# Altium project Battman.PrjPcb
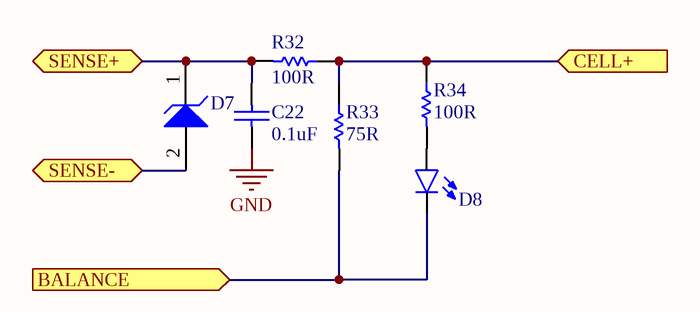
[diagram p0: Cell.SchDoc]
5 sheets, 37 parts. Net scope: hierarchical (ports join the sheet entries above them; power ports are global).
Board file: BMS.PcbDoc
Sheets:
  Cell.SchDoc
  BMS.SchDoc
    U_Switches = Switches.SchDoc
    U_Connectors = Connectors.SchDoc
    U_CurrentSense = CurrentSense.SchDoc

## Sheet Cell.SchDoc
size A; SheetNumber: 5

### Parts
C22  value 0.1uF  [C0402[1005X55]]  (hidden comment: 0.1uF 6.3V 0402)
D7  MM3Z12VT1G  [ONSC-SOD-323-2-477-02_V]  (value not drawn)
D8  LED_0603  [LED0603]  (value not drawn)
R32  value 100R  [R0402[1005]]  (hidden comment: 100R 1% 0402)
R33  value 75R  [R0603[1608]]  (hidden comment: 75R 1% 0603)
R34  value 100R  [R0402[1005]]  (hidden comment: 100R 1% 0402)

### Ports
BALANCE (in), CELL+ (in), SENSE+, SENSE- (bidir)

### Nets
GND: C22.1
NetC22_2: C22.2 D7.1(K) R32.1 ; port SENSE+
NetD7_2: D7.2(A) ; port SENSE-
NetD8_A: D8.A R34.1
NetD8_C: D8.C R33.1 ; port BALANCE
NetR32_2: R32.2 R33.2 R34.2 ; port CELL+

### Library data of the parts
C22 = CAP_0.1uF_6.3V_0402_10%: 0.1uF 6.3V 10% 0402 (1005 Metric); PartNumber: GRM155R70J104KA01D; Manufacturer: Murata; Tolerance: 10%; Mounting Technology: Surface Mount; PackageReference: 0402; PackageDescription: 0402 (1005 Metric); Voltage: 6.3V
D7 = CMP-1060-00726-1: Zener Voltage Regulator, 300 mW, 2-Pin SOD-323, Tape and Reel; Manufacturer: On Semiconductor; VZ Typ (V): 12; P Max (W): 0.3; Packing: Tape and Reel; ComponentLink3URL: http://www.onsemi.com/pub_link/Collateral/477-02.PDF.1; ComponentLink2Description: Datasheet; Mounting Technology: Surface Mount; PackageVersion: Rev. H, 03/2007; PackageDescription: 2-Pin SOD, Body 1.7 x 1.25 mm; ComponentLink1URL: http://www.onsemi.com/; ComponentLink1Description: Manufacturer URL; PartNumber: MM3Z12VT1G; ComponentLink3Description: Package Specification; ComponentLink2URL: http://www.onsemi.cn/pub_link/Collateral/MM3Z2V4T1-D.PDF; DatasheetVersion: Rev. 9; PackageReference: SOD-323-2-477-02
D8 = LED_0603: PartNumber: LTST-C193TBKT-5A; Manufacturer: Lite-On Inc.; PackageReference: 0603; PackageDescription: 0603 (1608 Metric); Mounting Technology: Surface Mount
R32 R34 = RES_100R_0402_1%: 100R 0.063W 1% 0402 (1005 Metric); Manufacturer: KOA Speer; PartNumber: RK73H1ETTP1000F; Power: 0.063W; Tolerance: 1%; Mounting Technology: Surface Mount; PackageReference: 0402; PackageDescription: 0402 (1005 Metric); ComponentLink1Description: Datasheet; ComponentLink1URL: http://www.koaspeer.com/catimages/Products/RK73H/RK73H.pdf
R33 = RES_75R_0603_1%: 75R 0.25W 1% 0603 (1005 Metric); Manufacturer: Vishay / Dale; PartNumber: CRCW060375R0FKEAHP; Tolerance: 1%; Power: 0.25W; Mounting Technology: Surface Mount; PackageReference: 0603; PackageDescription: 0603 (1608 Metric); ComponentLink1Description: Datasheet; ComponentLink1URL: http://www.vishay.com/docs/20043/crcwhpe3.pdf

## Sheet BMS.SchDoc
size A; SheetNumber: 1
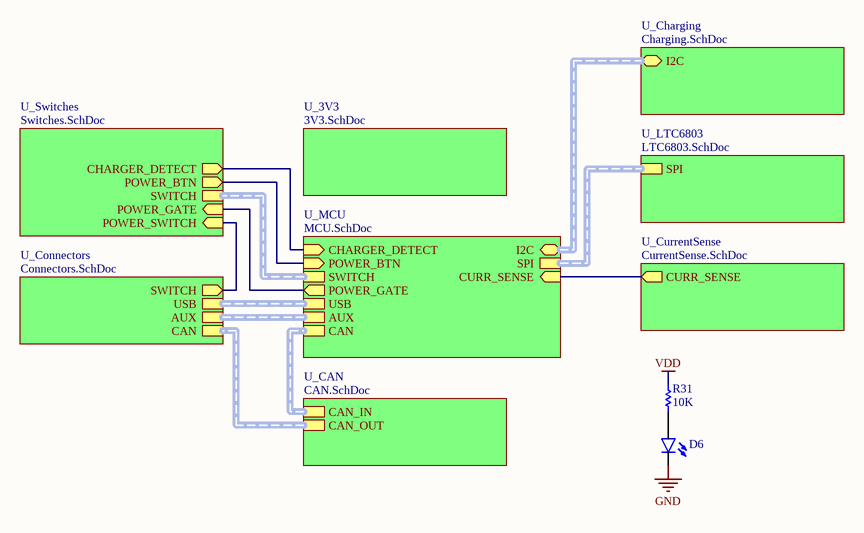
[diagram p1: BMS.SchDoc]

### Parts
D6  LED-BLUE  [LED0603]  (value not drawn)
R31  value 10K  [R0603[1608]]  (hidden comment: 10K 5% 0603)

### Sub-sheets
U_3V3 = 3V3.SchDoc (file not in this document): no entries
U_CAN = CAN.SchDoc (file not in this document): CAN_IN (harness CAN Input), CAN_OUT (harness CAN Output)
U_Charging = Charging.SchDoc (file not in this document): I2C (harness I2C)
U_Connectors = Connectors.SchDoc: USB (harness USB), AUX (harness Auxiliary Outputs), SWITCH (out), CAN (harness CAN Output)
U_CurrentSense = CurrentSense.SchDoc: CURR_SENSE (out)
U_LTC6803 = LTC6803.SchDoc (file not in this document): SPI (harness SPI)
U_MCU = MCU.SchDoc (file not in this document): CHARGER_DETECT (in), POWER_BTN (in), POWER_GATE (out), SPI (harness SPI), USB (harness USB), CAN (harness CAN Input), AUX (harness Auxiliary Outputs), SWITCH (harness Switches), CURR_SENSE (in), I2C (harness I2C)
U_Switches = Switches.SchDoc: POWER_GATE (in), POWER_BTN (out), CHARGER_DETECT (out), SWITCH (harness Switches), POWER_SWITCH (in)

### Nets
GND: D6.C
VDD: R31.2
NetD6_A: D6.A R31.1
NetJP4_1: sheet U_Switches/POWER_SWITCH, sheet U_Connectors/SWITCH
NetQ4_1: sheet U_MCU/CHARGER_DETECT, sheet U_Switches/CHARGER_DETECT
NetQ7_1: sheet U_MCU/POWER_GATE, sheet U_Switches/POWER_GATE
NetQ8_1: sheet U_MCU/POWER_BTN, sheet U_Switches/POWER_BTN
NetU9_5: sheet U_MCU/CURR_SENSE, sheet U_CurrentSense/CURR_SENSE

### Buses and harness runs
harness sheet U_CAN/CAN_IN = sheet U_MCU/CAN
harness sheet U_CAN/CAN_OUT = sheet U_Connectors/CAN
harness sheet U_Charging/I2C = sheet U_MCU/I2C
harness sheet U_Connectors/AUX = sheet U_MCU/AUX
harness sheet U_Connectors/USB = sheet U_MCU/USB
harness sheet U_LTC6803/SPI = sheet U_MCU/SPI
harness sheet U_MCU/SWITCH = sheet U_Switches/SWITCH

### Library data of the parts
D6 = LED_0603: as D8 on sheet Cell; PackageReference: 0603; PackageDescription: 0603 (1608 Metric); Mounting Technology: Surface Mount
R31 = RES_10K_0603_5%: 10K 0.25W 5% 0603 (1005 Metric); Manufacturer: Vishay; PartNumber: RCS060310K0JNEA; Tolerance: 5%; Power: 0.25W; Mounting Technology: Surface Mount; PackageReference: 0603; PackageDescription: 0603 (1608 Metric); ComponentLink1Description: Datasheet; ComponentLink1URL: http://www.vishay.com/docs/20065/rcse3.pdf

## Sheet Switches.SchDoc
size A; SheetNumber: 7
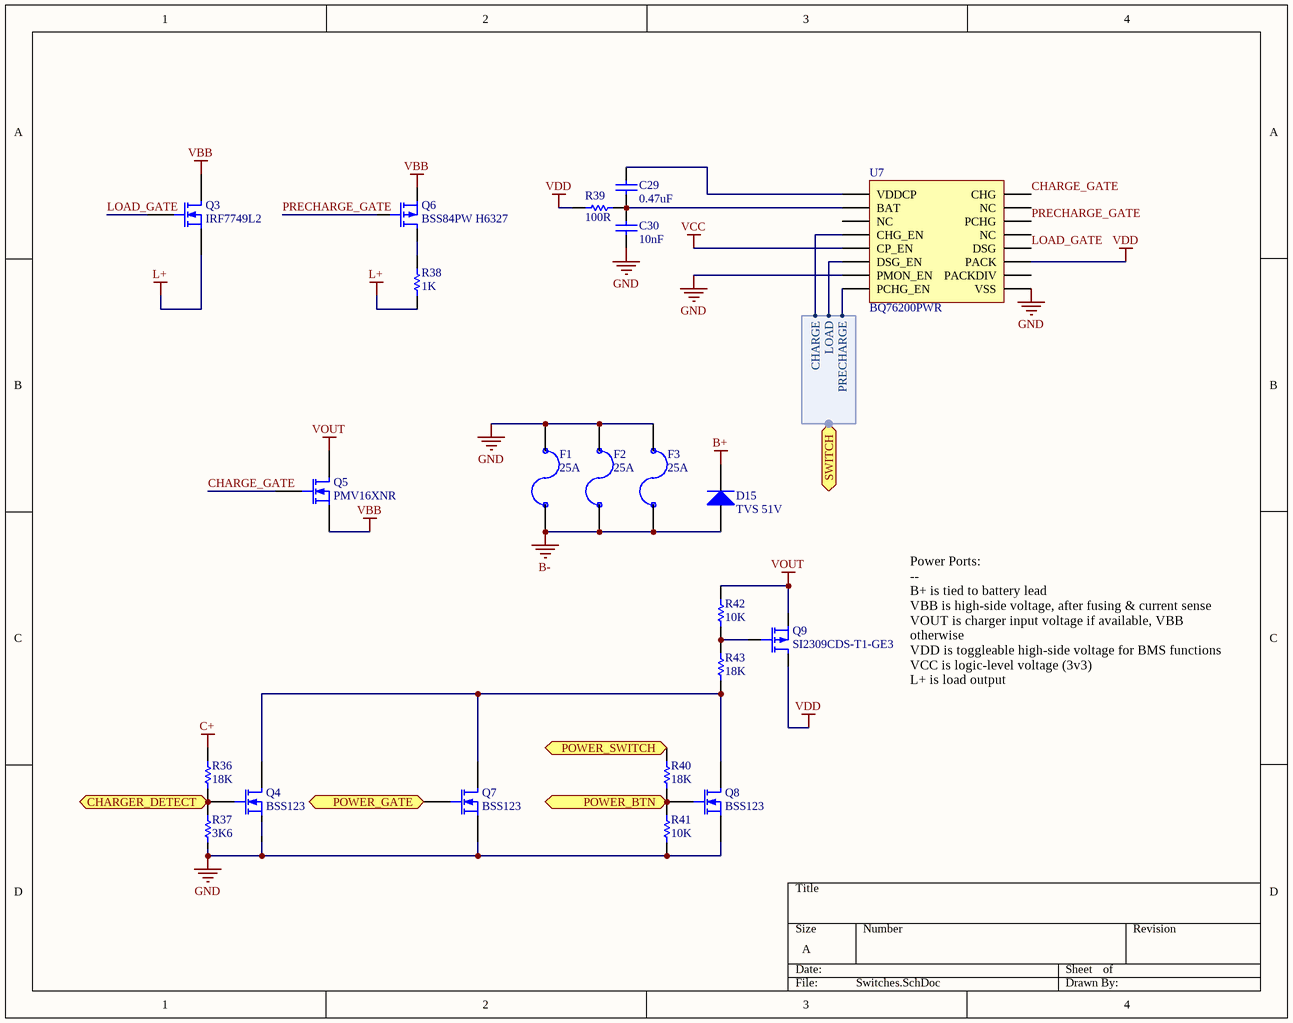
[diagram p2: Switches.SchDoc]

### Parts
C29  value 0.47uF  [C0603[1608X92]]  (hidden comment: 0.47uF 50V 0603)
C30  value 10nF  [C0402[1005X55]]  (hidden comment: 10nF 50V 0402)
D15  TVS 51V  [VISH-DO-214AC-2_N]
F1  Current: 25A  [1206_FUSE]  (hidden comment: FUSE 1206)
F2  Current: 25A  [1206_FUSE]  (hidden comment: FUSE 1206)
F3  Current: 25A  [1206_FUSE]  (hidden comment: FUSE 1206)
Q3  IRF7749L2  [DIRECTFET-9]
Q4  BSS123  [SOT323-3]
Q5  PMV16XNR  [SOT23-3]
Q6  BSS84PW H6327  [SOT323-3]
Q7  BSS123  [SOT323-3]
Q8  BSS123  [SOT323-3]
Q9  SI2309CDS-T1-GE3  [SOT23-3]
R36  value 18K  [R0402[1005]]  (hidden comment: 18K 1% 0402)
R37  value 3K6  [R0402[1005]]  (hidden comment: 3K6 1% 0402)
R38  value 1K  [R0805[2012]]  (hidden comment: 1K 1% 0805)
R39  value 100R  [R0402[1005]]  (hidden comment: 100R 1% 0402)
R40  value 18K  [R0402[1005]]  (hidden comment: 18K 1% 0402)
R41  value 10K  [R0402[1005]]  (hidden comment: 10K 1% 0402)
R42  value 10K  [R0402[1005]]  (hidden comment: 10K 1% 0402)
R43  value 18K  [R0402[1005]]  (hidden comment: 18K 1% 0402)
U7  BQ76200PWR  [TSSOP-16]

### Ports
CHARGER_DETECT (out), POWER_BTN (out), POWER_GATE (in), POWER_SWITCH (in), SWITCH (harness Switches)

### Harnesses
Switches: CHARGE, LOAD, PRECHARGE

### Nets
B+: D15.1(K)
B-: D15.2(A) F1.2 F2.2 F3.2
C+: R36.2
GND: C30.1 F1.1 F2.1 F3.1 Q4.2(S) Q7.2(S) Q8.2(S) R37.1 R41.1 U7.7(PMON_EN) U7.9(VSS)
L+: Q3.2(S) R38.1
VBB: Q3.3(D) Q5.2(S) Q6.2(S)
VCC: U7.5(CP_EN)
VDD: Q9.2(D) R39.1 U7.11(PACK)
VOUT: Q5.3(D) Q9.3(S) R42.2
CHARGE_GATE: Q5.1(G) U7.16(CHG)
LOAD_GATE: Q3.1(G) U7.12(DSG)
PRECHARGE_GATE: Q6.1(G) U7.14(PCHG)
NetC29_1: C29.1 C30.2 R39.2 U7.2(BAT)
NetC29_2: C29.2 U7.1(VDDCP)
NetJP4_1: R40.2 ; port POWER_SWITCH
NetQ4_1: Q4.1(G) R36.1 R37.2 ; port CHARGER_DETECT
NetQ4_3: Q4.3(D) Q7.3(D) Q8.3(D) R43.1
NetQ6_3: Q6.3(D) R38.2
NetQ7_1: Q7.1(G) ; port POWER_GATE
NetQ8_1: Q8.1(G) R40.1 R41.2 ; port POWER_BTN
NetQ9_1: Q9.1(G) R42.1 R43.2
NetU7_4: U7.4(CHG_EN) ; port SWITCH.CHARGE
NetU7_6: U7.6(DSG_EN) ; port SWITCH.LOAD
NetU7_8: U7.8(PCHG_EN) ; port SWITCH.PRECHARGE

Not connected (* = marked no-connect by the designer): U7 3(NC) 10(PACKDIV) 13(NC) 15(NC)

### Notes on the sheet
- Power Ports:
  --
  B+ is tied to battery lead
  VBB is high-side voltage, after fusing & current sense
  VOUT is charger input voltage if available, VBB otherwise
  VDD is toggleable high-side voltage for BMS functions
  VCC is logic-level voltage (3v3)
  L+ is load output

### Library data of the parts
C29 = CAP_0.47uF_50V_0603_10%: 0.47uF 50V 10% 0603 (1608 Metric); PartNumber: GRM188R61H474KA12D; Manufacturer: Murata; Tolerance: 10%; Mounting Technology: Surface Mount; PackageReference: 0603; PackageDescription: 0603 (1608 Metric); Voltage: 50V
C30 = CAP_10nF_50V_0402_10%: 10nF 50V 10% 0402 (1005 Metric); PartNumber: GCM155R71H103KA55D; Manufacturer: Murata; Tolerance: 10%; Mounting Technology: Surface Mount; PackageReference: 0402; PackageDescription: 0402 (1005 Metric); Voltage: 50V
D15 = CMP-0548-00253-1: Transient Voltage Suppressor, 6.40 to 231 V, 45 V Stand-off Voltage, Uni-Directional, -55 to 155 degC, 2-pin DO-214AC, Pb-Free, Tape and Reel; PartNumber: SMAJ51A-E3/61; Manufacturer: Vishay Semiconductor; IFSM: 40 A; VWM (V): 51; VBR Uni-Directional (V): 6.4 to 231; ID (uA): 1; PPPM (W): 400, 300; ComponentLink2Description: Datasheet; PackageReference: DO-214AC-2; ComponentLink3URL: http://www.vishay.com/docs/88390/smaj50a.pdf; DatasheetVersion: 12/8/2013; RoHS: TRUE; ComponentLink2URL: http://www.vishay.com/docs/88390/smaj50a.pdf; ComponentLink1Description: Manufacturer URL; PackageDescription: 2-Pin DO-214AC (SMA), Body 4.245 x 2.665 mm; Mounting Technology: Surface Mount; Packing: Tape and Reel; ComponentLink3Description: Package Specification; ComponentLink1URL: http://www.vishay.com/; Operating Junction and Storage Temperature Range: -55 to 150 degC
F1-F3 = FUSE 1206: Surface Mount Fuses UST 1206 FUSE 25A F; PartNumber: 3413.0332.22; Manufacturer: Schurter; Mounting Technology: Surface Mount; PackageReference: 1206; PackageDescription: 1206 (3216 Metric)
Q3 = IRF7749L2: N-Channel MOSFET; PartNumber: IRF7749L2TRPBF; Manufacturer: Infineon Technologies; PackageReference: DIRECTFET L8; PackageDescription: DirectFET™ Isometric L8; Mounting Technology: Surface Mount
Q4 Q7 Q8 = BSS123WQ-7-F: N-Channel MOSFET; Manufacturer: Diodes Incorporated; PackageReference: SOT-323-3; PartNumber: BSS123WQ-7-F; Mounting Technology: Surface Mount
Q5 = PMV16XNR: N-Channel MOSFET; pin to pad: 2>3 3>2; Manufacturer: NXP; PackageReference: SOT-23-3; PartNumber: PMV16XNR; Mounting Technology: Surface Mount
Q6 = BSS84PW H6327: P-Channel MOSFET; Manufacturer: Infineon; PackageReference: SOT323-3; Mounting Technology: Surface Mount; PartNumber: BSS84PW H6327
Q9 = SI2309CDS-T1-GE3: P-Channel MOSFET; Manufacturer: Vishay; PackageReference: SOT23-3; Mounting Technology: Surface Mount; PartNumber: SI2309CDS-T1-GE3
R36 R40 R43 = RES_18K_0402_1%: 18K 0.063W 1% 0402 (1005 Metric); Manufacturer: KOA Speer; PartNumber: RK73H1ETTP1802F; Power: 0.063W; Tolerance: 1%; Mounting Technology: Surface Mount; PackageReference: 0402; PackageDescription: 0402 (1005 Metric); ComponentLink1Description: Datasheet; ComponentLink1URL: http://www.koaspeer.com/catimages/Products/RK73H/RK73H.pdf
R37 = RES_3K6_0402_1%: 3K6 0.063W 1% 0402 (1005 Metric); Manufacturer: KOA Speer; PartNumber: RK73H1ETTP3601F; Tolerance: 1%; Power: 0.063W; Mounting Technology: Surface Mount; PackageReference: 0402; PackageDescription: 0402 (1005 Metric); ComponentLink1Description: Datasheet; ComponentLink1URL: http://www.koaspeer.com/catimages/Products/RK73H/RK73H.pdf
R38 = RES_1K_0805_1%: 1K 0.5W 1% 0805 (2012 Metric); Manufacturer: Panasonic; PartNumber: ERJ-P06F1001V; Tolerance: 1%; Power: 0.5W; Mounting Technology: Surface Mount; PackageReference: 0805; PackageDescription: 0805 (2012 Metric); ComponentLink1Description: Datasheet; ComponentLink1URL: https://industrial.panasonic.com/cdbs/www-data/pdf/RDA0000/AOA0000C243.pdf
R39 = RES_100R_0402_1%: as R32 on sheet Cell; Power: 0.063W; Tolerance: 1%; Mounting Technology: Surface Mount; PackageReference: 0402; PackageDescription: 0402 (1005 Metric); ComponentLink1Description: Datasheet; ComponentLink1URL: http://www.koaspeer.com/catimages/Products/RK73H/RK73H.pdf
R41 R42 = RES_10K_0402_1%: 10K 0.063W 1% 0402 (1005 Metric); Manufacturer: KOA Speer; PartNumber: RK73H1ETTP1002F; Power: 0.063W; Tolerance: 1%; Mounting Technology: Surface Mount; PackageReference: 0402; PackageDescription: 0402 (1005 Metric); ComponentLink1Description: Datasheet; ComponentLink1URL: http://www.koaspeer.com/catimages/Products/RK73H/RK73H.pdf
U7 = BQ76200PWR: Battery Management Fast high side NCH drive; Manufacturer: Texas Instruments; PartNumber: BQ76200PWR; PackageReference: TSSOP-16; Mounting Technology: Surface Mount

## Sheet Connectors.SchDoc
size A; SheetNumber: 10
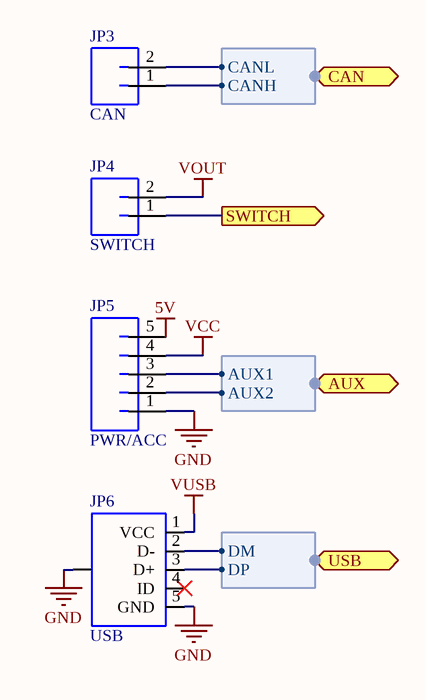
[diagram p3: Connectors.SchDoc]

### Parts
JP3  CAN  [JST-PH-2-PTH-VERT]
JP4  SWITCH  [JST-PH-2-PTH-VERT]
JP5  PWR/ACC  [JST-PH-5-PTH-VERT]
JP6  USB  [USB-MICROB]

### Ports
AUX (harness Auxiliary Outputs), CAN (harness CAN Output), SWITCH (out), USB (harness USB)

### Harnesses
USB: DM, DP
Auxiliary Outputs: AUX1, AUX2
CAN Output: CANL, CANH

### Nets
5V: JP5.5
GND: JP5.1 JP6.5(GND) JP6.6(SHIELD)
VCC: JP5.4
VOUT: JP4.2
VUSB: JP6.1(VCC)
NetJP3_1: JP3.1 ; port CAN.CANH
NetJP3_2: JP3.2 ; port CAN.CANL
NetJP4_1: JP4.1 ; port SWITCH
NetJP5_2: JP5.2 ; port AUX.AUX2
NetJP5_3: JP5.3 ; port AUX.AUX1
NetJP6_2: JP6.2(D-) ; port USB.DM
NetJP6_3: JP6.3(D+) ; port USB.DP

Not connected (* = marked no-connect by the designer): JP6 4(ID)*

### Library data of the parts
JP3 JP4 = JST_PH_2_VERT: Manufacturer: JST Sales America, Inc.; PartNumber: B2B-PH-K-S(LF)(SN); Mounting Technology: Through Hole; PackageReference: JST-PH
JP5 = JST_PH_5_VERT: Manufacturer: JST Sales America, Inc.; PartNumber: B5B-PH-K-S(LF)(SN); PackageReference: JST-PH; Mounting Technology: Through Hole
JP6 = USB_MICROB_SMT: pin to pad: 1>VBUS 2>D- 3>D+ 4>ID 5>GND 6>MT1+P$1+P$2+MT2; PartNumber: 10118192-0001LF; Manufacturer: Amphenol FCI; Mounting Technology: Surface Mount; PackageReference: USB - Micro B

## Sheet CurrentSense.SchDoc
size A; SheetNumber: 8
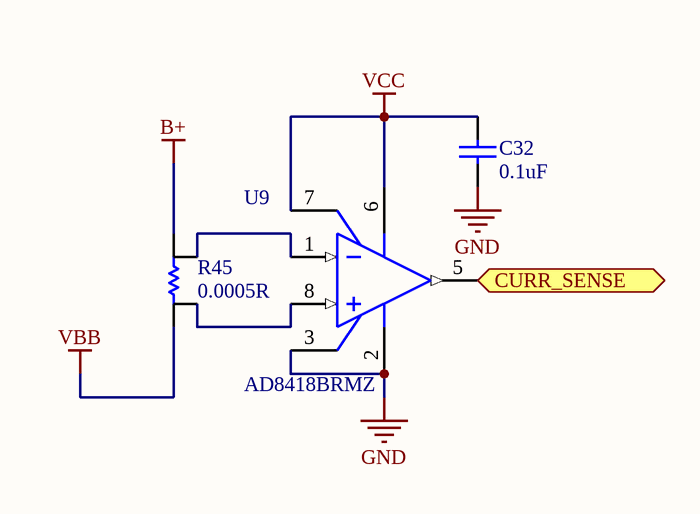
[diagram p4: CurrentSense.SchDoc]

### Parts
C32  value 0.1uF  [C0402[1005X55]]  (hidden comment: 0.1uF 6.3V 0402)
R45  value 0.0005R  [WSL2726]
U9  AD8418BRMZ  [MSOP-8]

### Ports
CURR_SENSE (out)

### Nets
B+: R45.2
GND: C32.1 U9.2(GND) U9.3(VREF2)
VBB: R45.1
VCC: C32.2 U9.6(VS) U9.7(VREF1)
NetR45_3: R45.3 U9.8(IN+)
NetR45_4: R45.4 U9.1(IN-)
NetU9_5: U9.5(OUT) ; port CURR_SENSE

### Library data of the parts
C32 = CAP_0.1uF_6.3V_0402_10%: as C22 on sheet Cell; Tolerance: 10%; Mounting Technology: Surface Mount; PackageReference: 0402; PackageDescription: 0402 (1005 Metric); Voltage: 6.3V
R45 = WSLP2726: Current Sense Resistor, 0.0005R; PartNumber: WSLP2726L5000FEA; Manufacturer: Vishay / Dale; Power: 7W; Tolerance: 1%; PackageReference: 2726; Mounting Technology: Surface Mount
U9 = AD8418BRMZ: Current Sense Amplifiers Zero Drift ,Precision Current Sense AMP; Manufacturer: Analog Devices; PartNumber: AD8418BRMZ; Mounting Technology: Surface Mount; PackageReference: MSOP-8; PackageDescription: SOP, 8-Leads, Body 3x3mm, Pitch 0.65mm, IPC Medium Density

## Nets that join several sheets
B+: Switches (D15.1), CurrentSense (R45.2)
GND: Cell (C22.1), BMS (D6.C), Switches (11 pins), Connectors (JP5.1 JP6.5 JP6.6), CurrentSense (C32.1 U9.2 U9.3)
VBB: Switches (Q3.3 Q5.2 Q6.2), CurrentSense (R45.1)
VCC: Switches (U7.5), Connectors (JP5.4), CurrentSense (C32.2 U9.6 U9.7)
VDD: BMS (R31.2), Switches (Q9.2 R39.1 U7.11)
VOUT: Switches (Q5.3 Q9.3 R42.2), Connectors (JP4.2)
NetJP4_1: Switches (R40.2), Connectors (JP4.1)